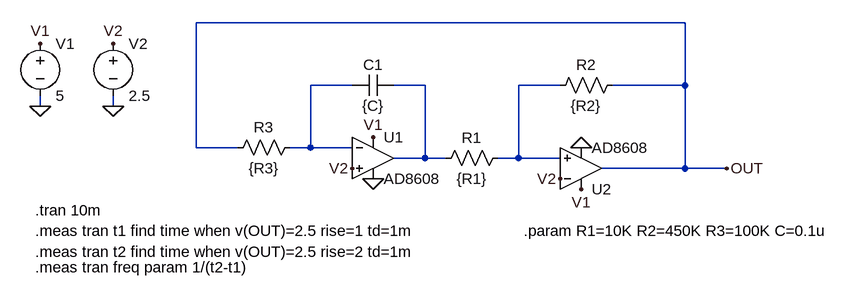
[diagram p0: schematic Draft1.asc]
Draft1.asc, the LTspice schematic file:
Version 4.1
SHEET 1 1272 680
WIRE 688 -48 -64 -48
WIRE 176 48 112 48
WIRE 288 48 240 48
WIRE 496 48 432 48
WIRE 688 48 688 -48
WIRE 688 48 576 48
WIRE -304 80 -304 64
WIRE -192 80 -192 64
WIRE -64 144 -64 -48
WIRE 0 144 -64 144
WIRE 112 144 112 48
WIRE 112 144 80 144
WIRE 176 144 112 144
WIRE 288 160 288 48
WIRE 288 160 240 160
WIRE 320 160 288 160
WIRE 432 160 432 48
WIRE 432 160 400 160
WIRE 496 160 432 160
WIRE 688 176 688 48
WIRE 688 176 560 176
WIRE 752 176 688 176
FLAG -304 80 0
FLAG -192 80 0
FLAG -304 -16 V1
FLAG 208 128 V1
FLAG 528 208 V1
FLAG -192 -16 V2
FLAG 176 176 V2
FLAG 496 192 V2
FLAG 208 192 0
FLAG 528 144 0
FLAG 752 176 OUT
SYMBOL res 416 144 R90
WINDOW 0 0 56 VBottom 2
WINDOW 3 32 56 VTop 2
SYMATTR InstName R1
SYMATTR Value {R1}
SYMBOL res 592 32 R90
WINDOW 0 0 56 VBottom 2
WINDOW 3 32 56 VTop 2
SYMATTR InstName R2
SYMATTR Value {R2}
SYMBOL res 96 128 R90
WINDOW 0 0 56 VBottom 2
WINDOW 3 32 56 VTop 2
SYMATTR InstName R3
SYMATTR Value {R3}
SYMBOL cap 240 32 R90
WINDOW 0 0 32 VBottom 2
WINDOW 3 32 32 VTop 2
SYMATTR InstName C1
SYMATTR Value {C}
SYMBOL voltage -304 -32 R0
WINDOW 123 0 0 Left 0
WINDOW 39 0 0 Left 0
SYMATTR InstName V1
SYMATTR Value 5
SYMBOL voltage -192 -32 R0
WINDOW 123 0 0 Left 0
WINDOW 39 0 0 Left 0
SYMATTR InstName V2
SYMATTR Value 2.5
SYMBOL OpAmps\\AD8608 208 96 R0
SYMATTR InstName U1
SYMBOL OpAmps\\AD8608 528 240 M180
SYMATTR InstName U2
TEXT 440 272 Left 2 !.param R1=10K R2=450K R3=100K C=0.1u
TEXT -312 240 Left 2 !.tran 10m
TEXT -312 272 Left 2 !.meas tran t1 find time when v(OUT)=2.5 rise=1 td=1m
TEXT -312 304 Left 2 !.meas tran t2 find time when v(OUT)=2.5 rise=2 td=1m
TEXT -312 328 Left 2 !.meas tran freq param 1/(t2-t1)

The netlist it stands for:
* Draft1.asc
R1 N003 N002 {R1}
R2 OUT N003 {R2}
R3 N001 OUT {R3}
C1 N002 N001 {C}
V1 V1 0 5
V2 V2 0 2.5
X§U1 V2 N001 V1 0 N002 AD8608  ; pins In+ In- V+ V- OUT
X§U2 N003 V2 V1 0 OUT AD8608  ; pins In+ In- V+ V- OUT
.param R1=10K R2=450K R3=100K C=0.1u
.tran 10m
.meas tran t1 find time when v(OUT)=2.5 rise=1 td=1m
.meas tran t2 find time when v(OUT)=2.5 rise=2 td=1m
.meas tran freq param 1/(t2-t1)
.backanno
.end